# Altium schematic sheet FTM_SCH.SchDoc
size A; SheetNumber: 1; SheetTotal: 1
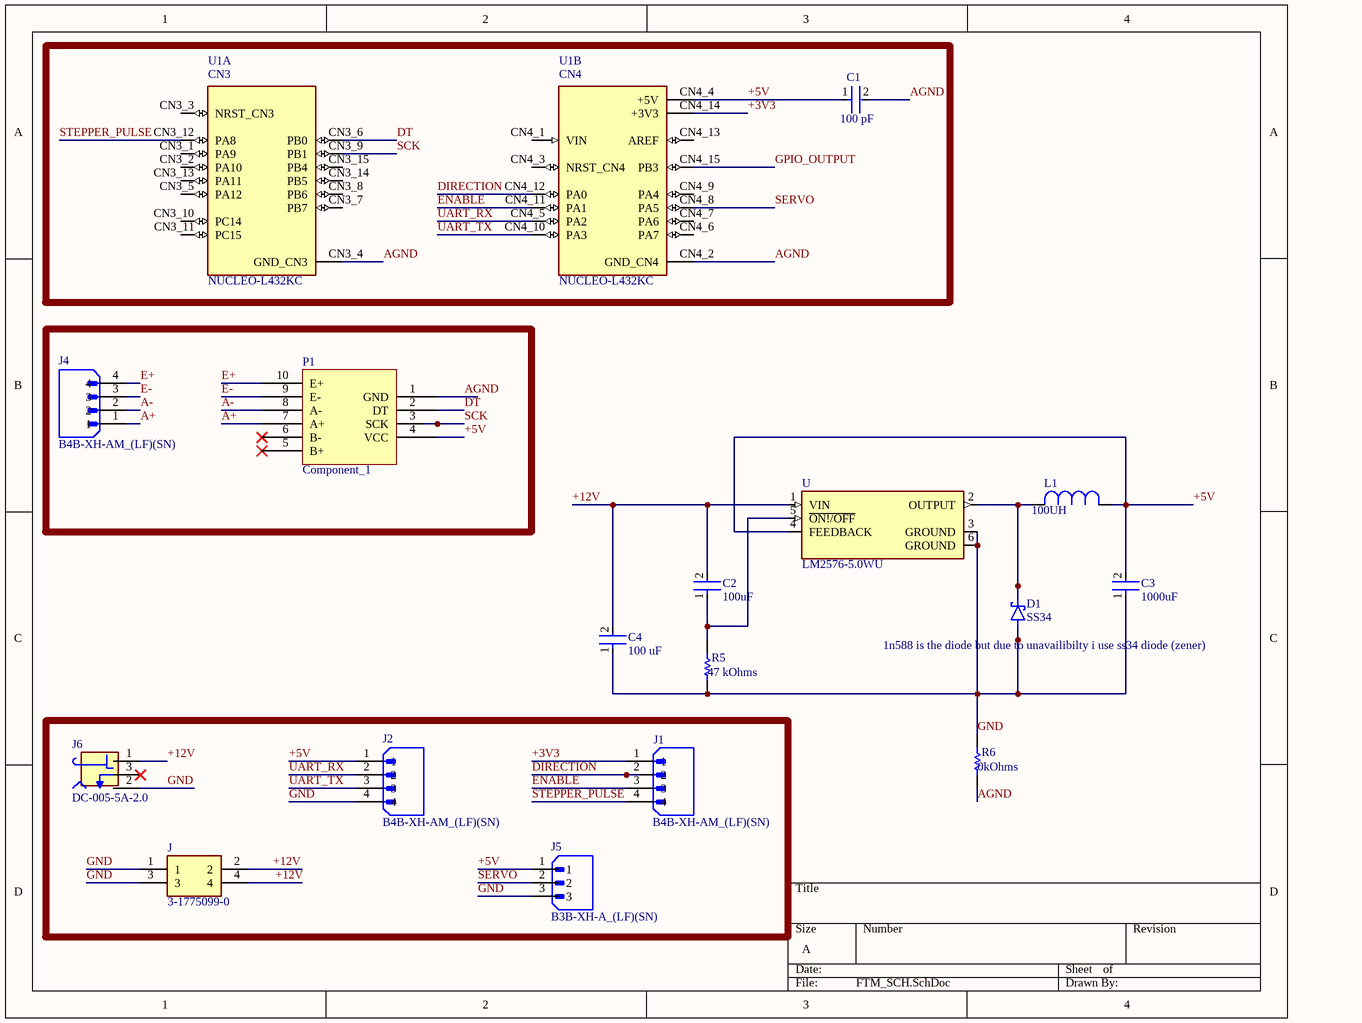
[diagram p0: FTM_SCH.SchDoc]

## Parts
C1  Capacitance: 100 pF  [FP-C1206C-EB-MFG]  (hidden comment: C1206C101J1GACTU)
C2  Capacitance: 100uF  [FP-C1206C-EB-MFG]  (hidden comment: C1206C101J1GACTU)
C3  Capacitance: 1000uF  [FP-C1206C-EB-MFG]  (hidden comment: C1206C101J1GACTU)
C4  Capacitance: 100 uF  [FP-C1206C-EB-MFG]  (hidden comment: C1206C101J1GACTU)
D1  SS34  [DIOM7959X265N]
J  3-1775099-0  [TE_3-1775099-0]
J1  B4B-XH-AM_(LF)(SN)  [JST_B4B-XH-AM_(LF)(SN)]
J2  B4B-XH-AM_(LF)(SN)  [JST_B4B-XH-AM_(LF)(SN)]
J4  B4B-XH-AM_(LF)(SN)  [JST_B4B-XH-AM_(LF)(SN)]
J5  B3B-XH-A_(LF)(SN)  [JST_B3B-XH-A (LF)(SN)]
J6  DC-005-5A-2.0  [XKB_DC-005-5A-2.0]
L1  value 100UH  [IND_CDRH127/LDNP-470MC_SUM]  (hidden comment: CDRH127/LDNP-470MC)
P1  Component_1  [PCBComponent_1]
R5  value 47 kOhms  [RESC3216X70X50LL05T20]  (hidden comment: ERJ-8ENF1001V)
R6  value 0kOhms  [RESC3216X70X50LL05T20]  (hidden comment: ERJ-8ENF1001V)
U  LM2576-5.0WU  [DPAK6P170_1524X459L254X81N]
U1  NUCLEO-L432KC  [MODULE_NUCLEO-L432KC]  (parts A,B of 2)

## Nets
+3V3: J1.1 U1.CN4_14(+3V3)
+5V: C1.1 C3.2 J2.1 J5.1 L1.1 P1.4(VCC) U.4(FEEDBACK) U1.CN4_4(+5V)
+12V: C2.2 C4.2 J.2 J.4 J6.1 U.1(VIN)
A+: J4.1 P1.7(A+)
A-: J4.2 P1.8(A-)
AGND: C1.2 P1.1(GND) R6.1 U1.CN3_4(GND_CN3) U1.CN4_2(GND_CN4)
DIRECTION: J1.2 U1.CN4_12(PA0)
DT: P1.2(DT) U1.CN3_6(PB0)
E+: J4.4 P1.10(E+)
E-: J4.3 P1.9(E-)
ENABLE: J1.3 U1.CN4_11(PA1)
GND: C3.1 C4.1 D1.A J.1 J.3 J2.4 J5.3 J6.2 R5.1 R6.2 U.3(GROUND) U.6(GROUND)
GPIO_OUTPUT: U1.CN4_15(PB3)
SCK: P1.3(SCK) U1.CN3_9(PB1)
SERVO: J5.2 U1.CN4_8(PA5)
STEPPER_PULSE: J1.4 U1.CN3_12(PA8)
UART_RX: J2.2 U1.CN4_5(PA2)
UART_TX: J2.3 U1.CN4_10(PA3)
NetC2_1: C2.1 R5.2 U.5(~{ON!/OFF})
NetD1_C: D1.C(K) L1.2 U.2(OUTPUT)

Not connected (* = marked no-connect by the designer): J6 3*; P1 5(B+)* 6(B-)*; U1 CN3_1(PA9) CN3_2(PA10) CN3_3(NRST_CN3) CN3_5(PA12) CN3_7(PB7) CN3_8(PB6) CN3_10(PC14) CN3_11(PC15) CN3_13(PA11) CN3_14(PB5) CN3_15(PB4) CN4_1(VIN) CN4_3(NRST_CN4) CN4_6(PA7) CN4_7(PA6) CN4_9(PA4) CN4_13(AREF)

## Notes on the sheet
- (near D1) 1n588 is the diode but due to unavailibilty i use ss34 diode (zener)
- (in symbol NUCLEO-L432KC, part A) CN3
- (in symbol NUCLEO-L432KC, part B) CN4

## Library data of the parts
C1-C4 = CMP-03020-011698-1: CAP CER 100PF 100V C0G/NP0 1206; Manufacturer: KEMET; Temperature Characteristic: C0G; Temperature Coefficient: 15%; Tolerance: 0.05; Automotive Grade: Grade 0; Material: Ceramic; Temperature Range Low: -55°C; Device Class L3: Ceramic Capacitors; Temperature: -55°C to +150°C; Value: 100 pF; ComponentLink2URL: https://content.kemet.com/datasheets/KEM_C1007_X8R_ULTRA_150C_SMD.pdf; Ipc Land Pattern Name: CAPC320160X78; Mouser Description: Multilayer Ceramic Capacitors MLCC - SMD/SMT 100volts 100pF C0G 5%; Automotive: Yes; Voltage Rating: 100 V; Octopart: https://octopart.com/c1206c101j1gactu-kemet-98729; Height: 0.88mm; RoHS: TRUE; Lead Free: Yes; Device Class L1: Passive Components; Package: C1206C-EB; Digikey Description: CAP CER 100PF 100V C0G/NP0 1206; ComponentLink2Description: Datasheet; Temperature Range High: +150°C; Category: Cap; Manufacturer Part Number: C1206C101J1GACTU; Device Class L2: Capacitors
D1 = SS34: Diode Schottky 40 V 3A Surface Mount SMC (DO-214AB); MF: onsemi; SnapEDA_Link: https://www.snapeda.com/parts/SS34/Onsemi/view-part/?ref=snap; Package: SMC-2 ON Semiconductor; Value: *; MP: SS34; Check_prices: https://www.snapeda.com/parts/SS34/Onsemi/view-part/?ref=eda
J = 3-1775099-0: Conn Power PL 4 POS 4.2mm Solder ST Thru-Hole 4 Terminal 1 Port Tray; MF: TE Connectivity; SnapEDA_Link: https://www.snapeda.com/parts/3-1775099-0/TE%20Connectivity%20AMP%20Connectors/view-part/857303/?ref=snap; Value: *; Availability: Unavailable; MP: 3-1775099-0; Price: None; Package: None
J1 J2 J4 = B4B-XH-AM_(LF)(SN): Conn Shrouded Header HDR 4 POS 2.5mm Solder ST Top Entry Thru-Hole Box; MF: JST Corporation; MP: B4B-XH-AM (LF)(SN); Package: None; Price: None; Check_prices: https://www.snapeda.com/parts/B4B-XH-AM%20(LF)(SN)/JST/view-part/?ref=eda; Value: *; SnapEDA_Link: https://www.snapeda.com/parts/B4B-XH-AM%20(LF)(SN)/JST/view-part/?ref=snap; Availability: In Stock; Purchase-URL: https://pricing.snapeda.com/search?q=B4B-XH-AM (LF)(SN)&ref=eda
J5 = B3B-XH-A_(LF)(SN): Connector Header Through Hole 3 position 0.098 (2.50mm); MF: JST Sales America Inc.; MP: B3B-XH-A (LF)(SN); SnapEDA_Link: https://www.snapeda.com/parts/B3B-XH-A%20(LF)(SN)/JST+Sales+America+Inc./view-part/?ref=snap; Package: None; Value: *; Check_prices: https://www.snapeda.com/parts/B3B-XH-A%20(LF)(SN)/JST+Sales+America+Inc./view-part/?ref=eda
J6 = DC-005-5A-2.0: DC Power Receptacle Jack, Through Holeï¼ŒRight Angle; MF: XKB Industrial Precision; SnapEDA_Link: https://www.snapeda.com/parts/DC-005-5A-2.0/XKB+Industrial+Precision/view-part/?ref=snap; Package: Package; Value: *; MP: DC-005-5A-2.0; Check_prices: https://www.snapeda.com/parts/DC-005-5A-2.0/XKB+Industrial+Precision/view-part/?ref=eda
L1 = CDRH127/LDNP-470MC: 47 ÂµH Shielded - Inductor 3.25 A 78mOhm Max Nonstandard; MF: Sumida America; SnapEDA_Link: https://www.snapeda.com/parts/CDRH127/LDNP-470MC/Sumida+America+Components+Inc./view-part/?ref=snap; MP: CDRH127/LDNP-470MC; Availability: In Stock; Price: None; Check_prices: https://www.snapeda.com/parts/CDRH127/LDNP-470MC/Sumida+America+Components+Inc./view-part/?ref=eda; Package: Nonstandard Sumida; Purchase-URL: https://pricing.snapeda.com/search/part/CDRH127/LDNP-470MC/?ref=eda
R5 R6 = CMP-2003-00017-1: Manufacturer: Panasonic; Part Number: ERJ-8ENF1001V
U = LM2576-5.0WU: Buck Switching Regulator IC Positive Fixed 5V 1 Output 3A TO-263-6, DÂ²Pak _5 Leads + Tab_, TO-263BA; MF: Microchip; Value: *; MP: LM2576-5.0WU; SnapEDA_Link: https://www.snapeda.com/parts/LM2576-5.0WU/Microchip/view-part/104848/?ref=snap; Availability: Unavailable; Package: TO-263-5 Micrel; Price: None
U1 = NUCLEO-L432KC: STM32 Nucleo-32 development board with STM32L432KC MCU, supports Arduino connectivity; Package: None; Price: None; Availability: Unavailable; MP: NUCLEO-L432KC; Value: *